# Altium schematic sheet Page13 IMU_DISPLAY.SchDoc
size A3; SheetNumber: 13; SheetTotal: 13
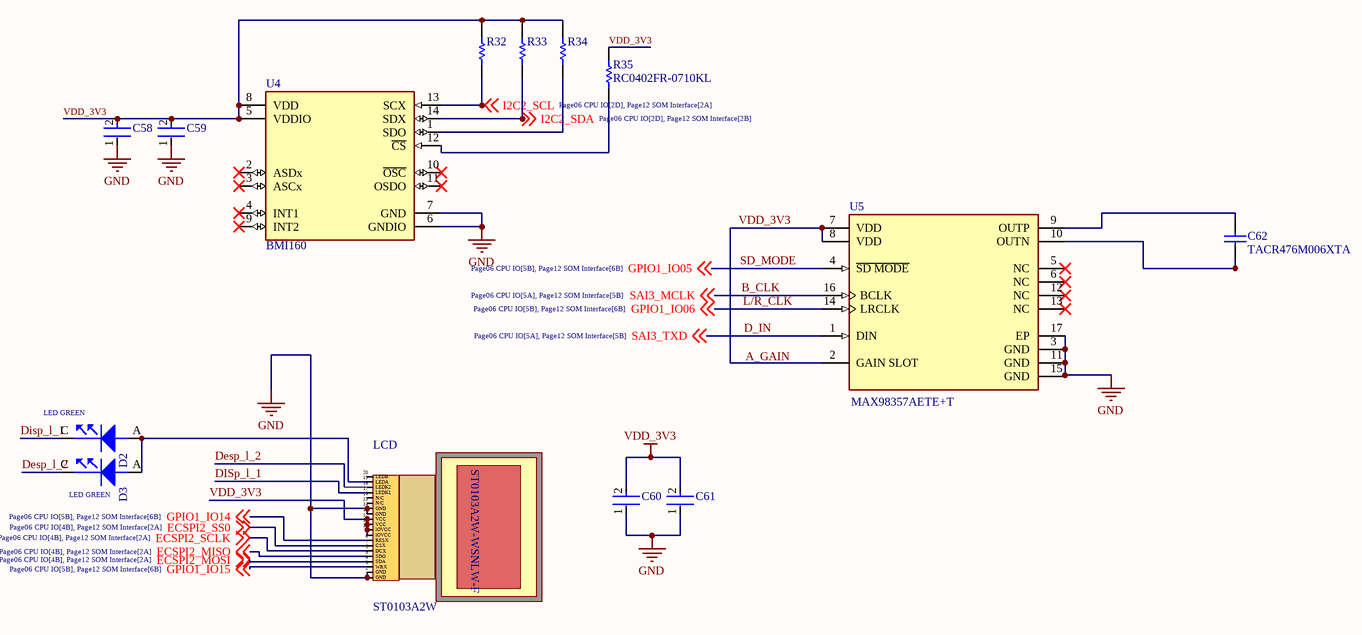
[diagram p0: Page13 IMU_DISPLAY.SchDoc]

## Parts
C58  GRM155R71C104KA88D  [FP-GRM15-MFG]  (value not drawn)
C59  GRM155R71C104KA88D  [FP-GRM15-MFG]  (value not drawn)
C60  GRM155R71C104KA88D  [FP-GRM15-MFG]  (value not drawn)
C61  GRM155R71C104KA88D  [FP-GRM15-MFG]  (value not drawn)
C62  TACR476M006XTA  [CAPC2014X150X70LL20]
D2  LED GREEN  [LED_0603]
D3  LED GREEN  [LED_0603]
LCD  ST0103A2W  [DPAK70P1823X500-20N]
R32  RC0402FR-0710KL  [RESC1005X40X25LL05T10]  (value not drawn)
R33  RC0402FR-0710KL  [RESC1005X40X25LL05T10]  (value not drawn)
R34  RC0402FR-0710KL  [RESC1005X40X25LL05T10]  (value not drawn)
R35  RC0402FR-0710KL  [RESC1005X40X25LL05T10]
U4  BMI160  [FP-BMI160-MFG]
U5  MAX98357AETE+T  [FP-T1633-4-MFG]

## Nets
GND: C58.1 C59.1 C60.1 C61.1 LCD.1(GND) LCD.2(GND) LCD.13(GND) LCD.14(GND) U4.6(GNDIO) U4.7(GND) U5.3(GND) U5.11(GND) U5.15(GND) U5.17(EP)
VDD_3V3: C58.2 C59.2 C60.2 C61.2 LCD.9(lOVCC) LCD.10(lOVCC) LCD.11(VCC) LCD.12(VCC) R32.2 R33.2 R34.2 R35.2 U4.5(VDDIO) U4.8(VDD) U5.2(GAIN_SLOT) U5.7(VDD) U5.8(VDD)
B_CLK: U5.16(BCLK) ; off-sheet SAI3_MCLK  [also labelled SAI3_MCLK]
D_IN: U5.1(DIN) ; off-sheet SAI3_TXD  [also labelled SAI3_TXD]
Desp_l_2: D3.C(CATHODE) LCD.18(LEDK2)
Disp_l_1: D2.C(CATHODE) LCD.17(LEDK1)
ECSPI2_MISO: LCD.5(SDO) ; off-sheet ECSPI2_MISO
ECSPI2_MOSI: LCD.4(SDA) ; off-sheet ECSPI2_MOSI
ECSPI2_SCLK: LCD.6(DCX) ; off-sheet ECSPI2_SCLK
ECSPI2_SS0: LCD.7(CSX) ; off-sheet ECSPI2_SS0
GPIO1_IO14: LCD.8(RESX) ; off-sheet GPIO1_IO14
GPIO1_IO15: LCD.3(WRX) ; off-sheet GPIO1_IO15
I2C2_SCL: R32.1 U4.13(SCX) ; off-sheet I2C2_SCL
I2C2_SDA: R33.1 U4.14(SDX) ; off-sheet I2C2_SDA
L/R_CLK: U5.14(LRCLK) ; off-sheet GPIO1_IO06  [also labelled GPIO1_IO06]
SD_MODE: U5.4(~{SD_MODE}) ; off-sheet GPIO1_IO05  [also labelled GPIO1_IO05]
NetC62_1: C62.1 U5.10(OUTN)
NetC62_2: C62.2 U5.9(OUTP)
NetD2_A: D2.A(ANODE) D3.A(ANODE) LCD.19(LEDA)
NetR34_1: R34.1 U4.1(SDO)
NetR35_1: R35.1 U4.12(~{CS})

Not connected (* = marked no-connect by the designer): LCD 15(N/C) 16(N/C) 20(LEDB); U4 2(ASDx)* 3(ASCx)* 4(INT1)* 9(INT2)* 10(~{OSC})* 11(OSDO)*; U5 5(NC)* 6(NC)* 12(NC)* 13(NC)*

## Notes on the sheet
- Labels drawn without touching a wire or pin: A_GAIN
- (in symbol ST0103A2W) ST0103A2W-WSNLW-F

## Library data of the parts
C58-C61 = CMP-2100-03641-2: CAP CER 0.1UF 16V X7R 0402; Manufacturer: Murata; Standoff Height: 0mm; Tolerance: 10%; Voltage Rating: 16Vdc; Material: Ceramic; Capacitance: 0.10μF; Value: 0.10μF; RoHS: TRUE; Manufacturer Part Number: GRM155R71C104KA88D; Temperature Characteristic: X7R; Octopart: https://octopart.com/grm155r71c104ka88d-murata-196880; Digikey Description: CAP CER 0.1UF 16V X7R 0402; Device Class L3: Ceramic Capacitors; Height: 0.55mm; ComponentLink2Description: Datasheet; Temperature Range Low: -55°C; Ipc Land Pattern Name: CAPC10050X219; ComponentLink2URL: https://search.murata.co.jp/Ceramy/image/img/A01X/G101/ENG/GRM155R71H471KA01-01A.pdf; Device Class L1: Passive Components; Lead Free: yes; Category: Cap; Package: GRM15; Temperature: -55°C to +125°C; Device Class L2: Capacitors; Temperature Range High: +125°C; Mouser Description: 0402 0.1 uF 16V ±10 % Tolerance X7R SMT Multilayer Ceramic Capacitor
C62 = CMP-2007-00044-1: Manufacturer: AVX Interconnect / Elco; Part Number: TACR476M006XTA
D2 D3 = LED: LED GRN SGL 25MA SMT 0603; CLASS: IC; VOLTAGE: 2V; AGILE_PN: 370-76672; MFG_NAME01: DIALIGHT; MFG_PN01: 598-8070-107F; CAD_APPROVED: Yes; ROHS: Yes; HEIGHT: 0.8 MM; PCB Footprint: LED_0603
R32-R35 = CMP-2002-07353-1: Manufacturer: Yageo / Phycomp; Part Number: RC0402FR-0710KL
U4 = CMP-2000-07537-3: IMU ACCEL/GYRO I2C/SPI 14LGA; Sensor Type: Accelerometer; Output Type: SPI; Mount: Surface Mount; Max Operating Temperature: 85°C; Case/Package: LGA; Min Operating Temperature: -40°C; Packaging: Cut Tape; Lead Free: Lead Free
U5 = CMP-05698-000018-1: IC AMP CLASS D MONO 3.2W 16TQFN; Max Supply Voltage: 5.5V; Max Output Current: 1.6A; Voltage Gain: 15dB; Max Power Dissipation: 1.666W; Min Supply Voltage: 2.5V; Power Supply Rejection Ratio (PSRR): 77dB; Series: -; Contact Plating: Tin; Min Operating Temperature: -40°C; Packaging: Tape and Reel; Max Output Power: 3.2W; Mount: Surface Mount; Number of Pins: 16; RoHS Compliant: Yes; Max Operating Temperature: 85°C; Radiation Hardening: No